# EasyEDA schematic SCH_CapibaraZero_PCB_2024-12-05.json

## Sheets
1 Sheet_1: TITLE: Sheet_1; REV: 1.0; Date: 2024-12-05; Sheet: 1/1; Drawn By: andreock; Company: Your Company
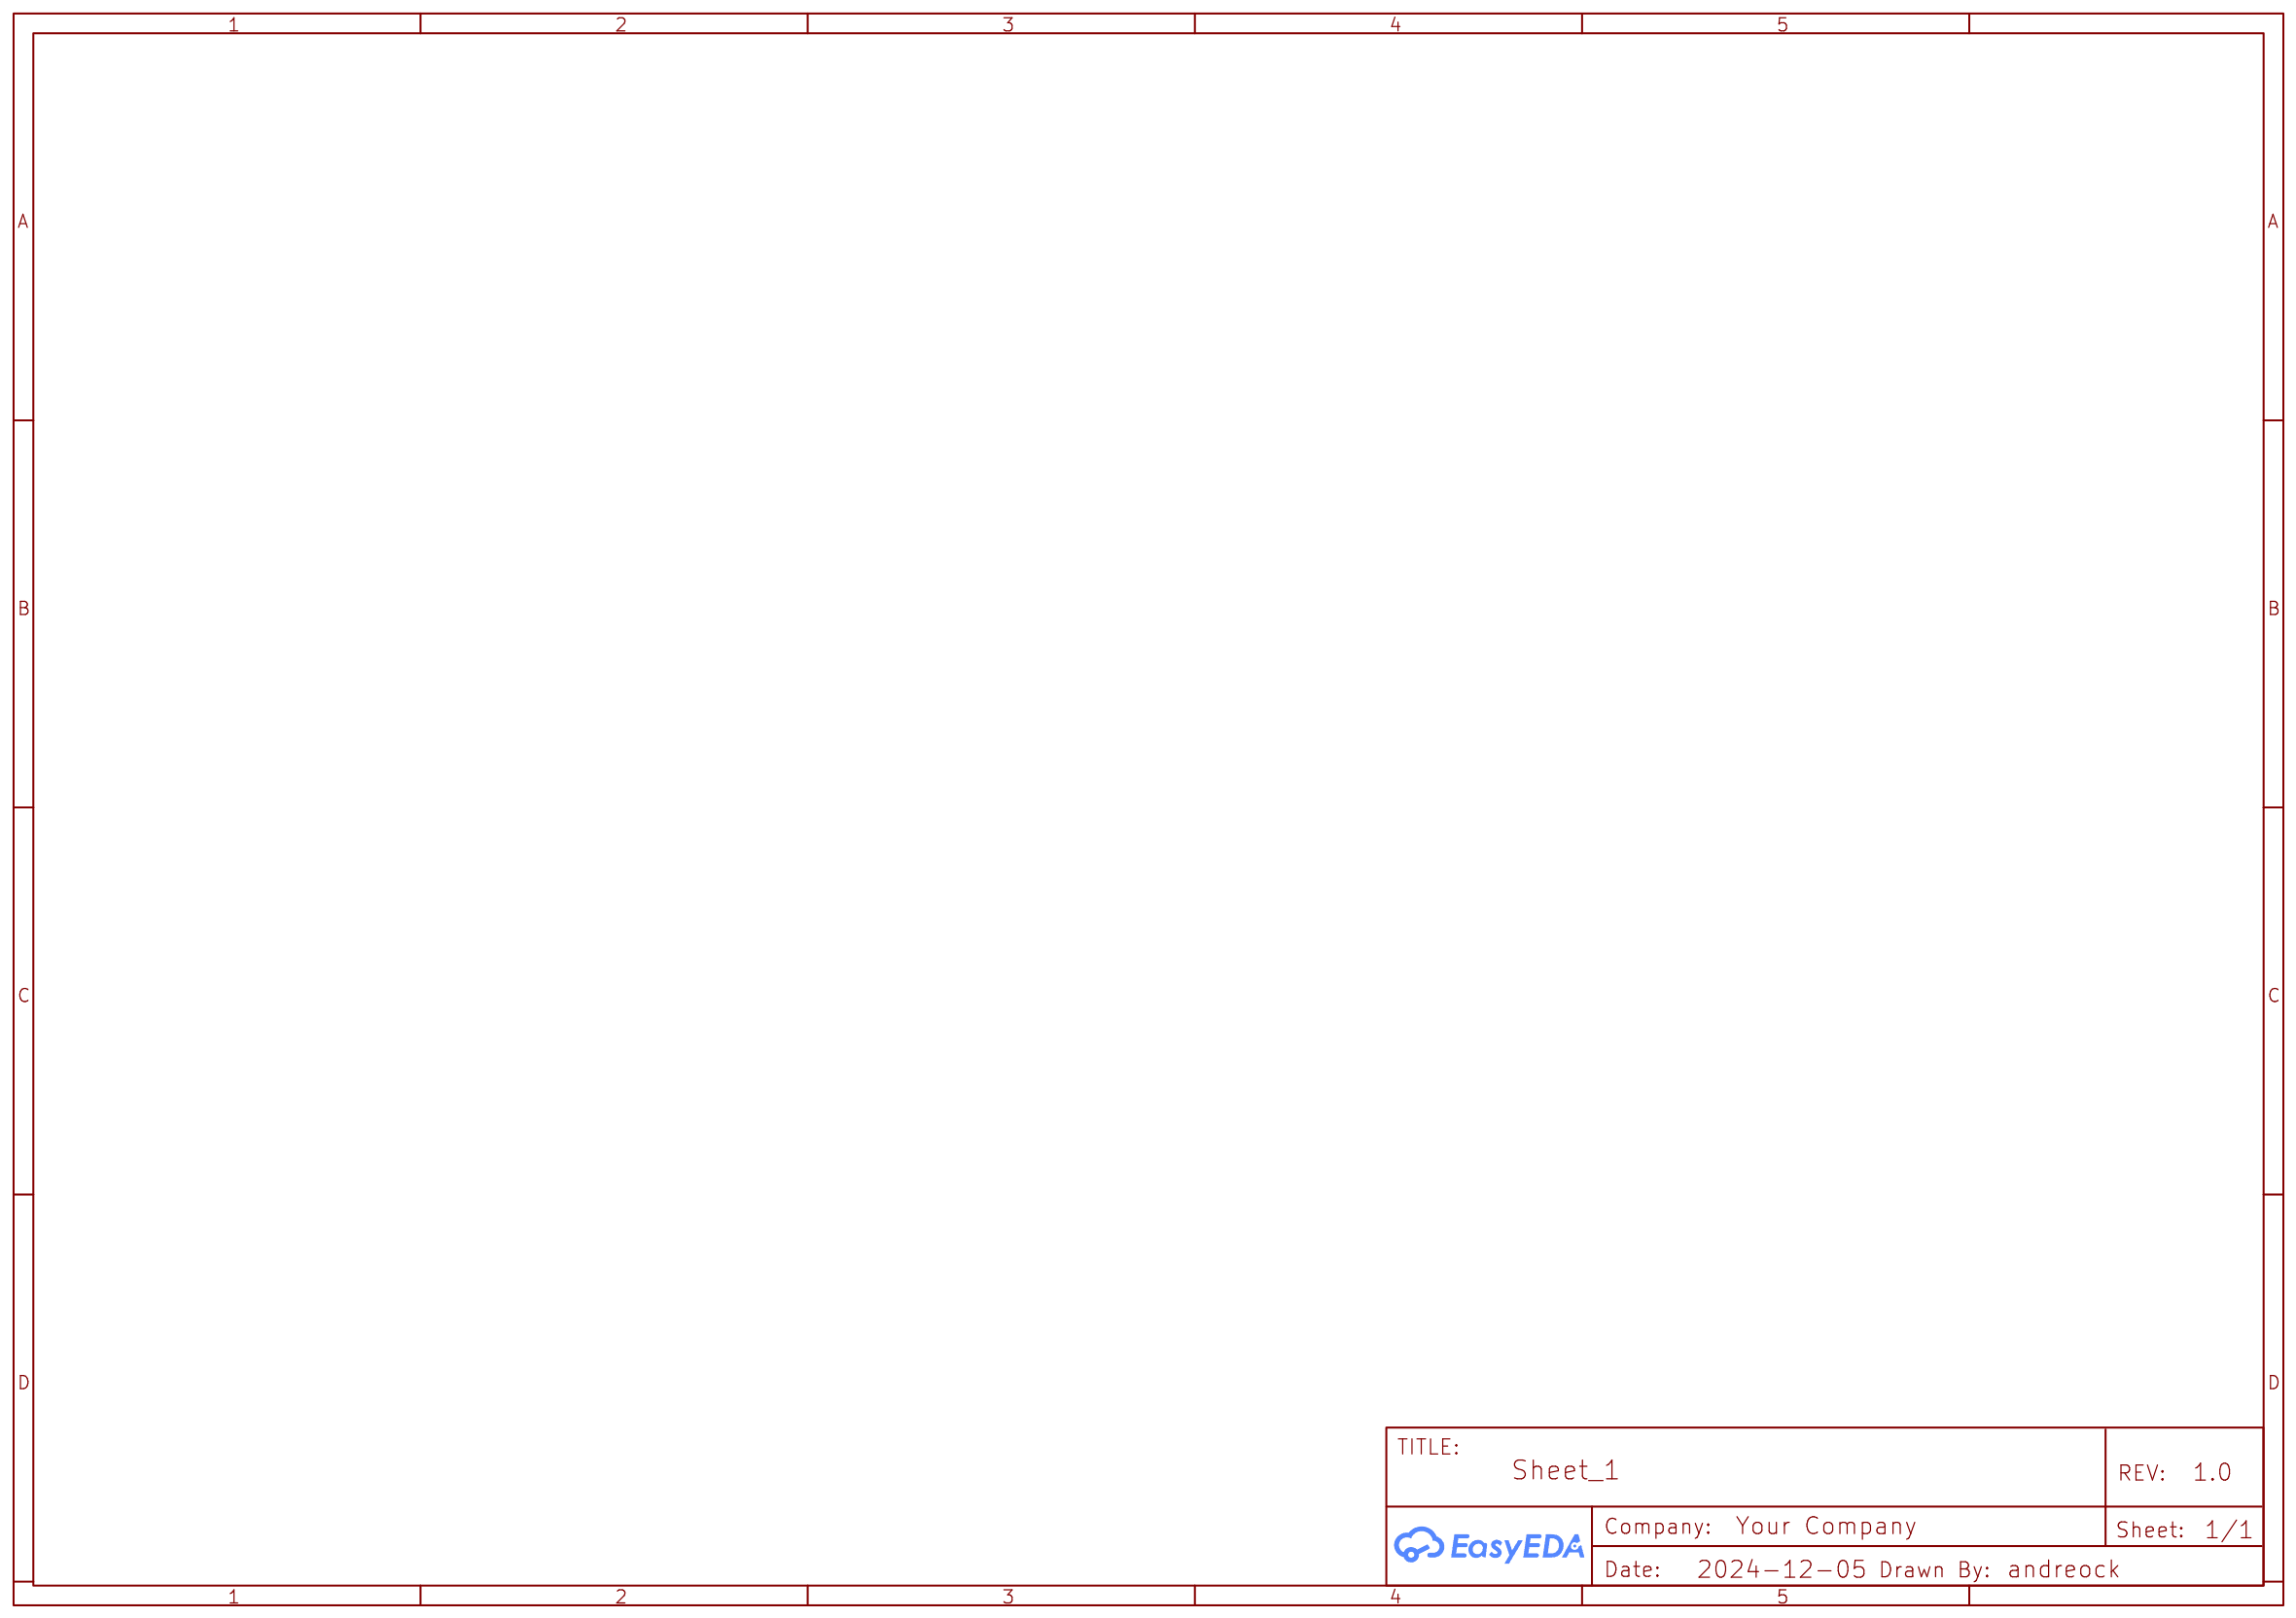
[diagram p0: Sheet_1]
2 CapibaraZero_Main_Scheme: TITLE: CapibaraZero_ESP32-S3; Date: 2024-04-09; Drawn By: Andrea Canale; Company: CapibaraZero
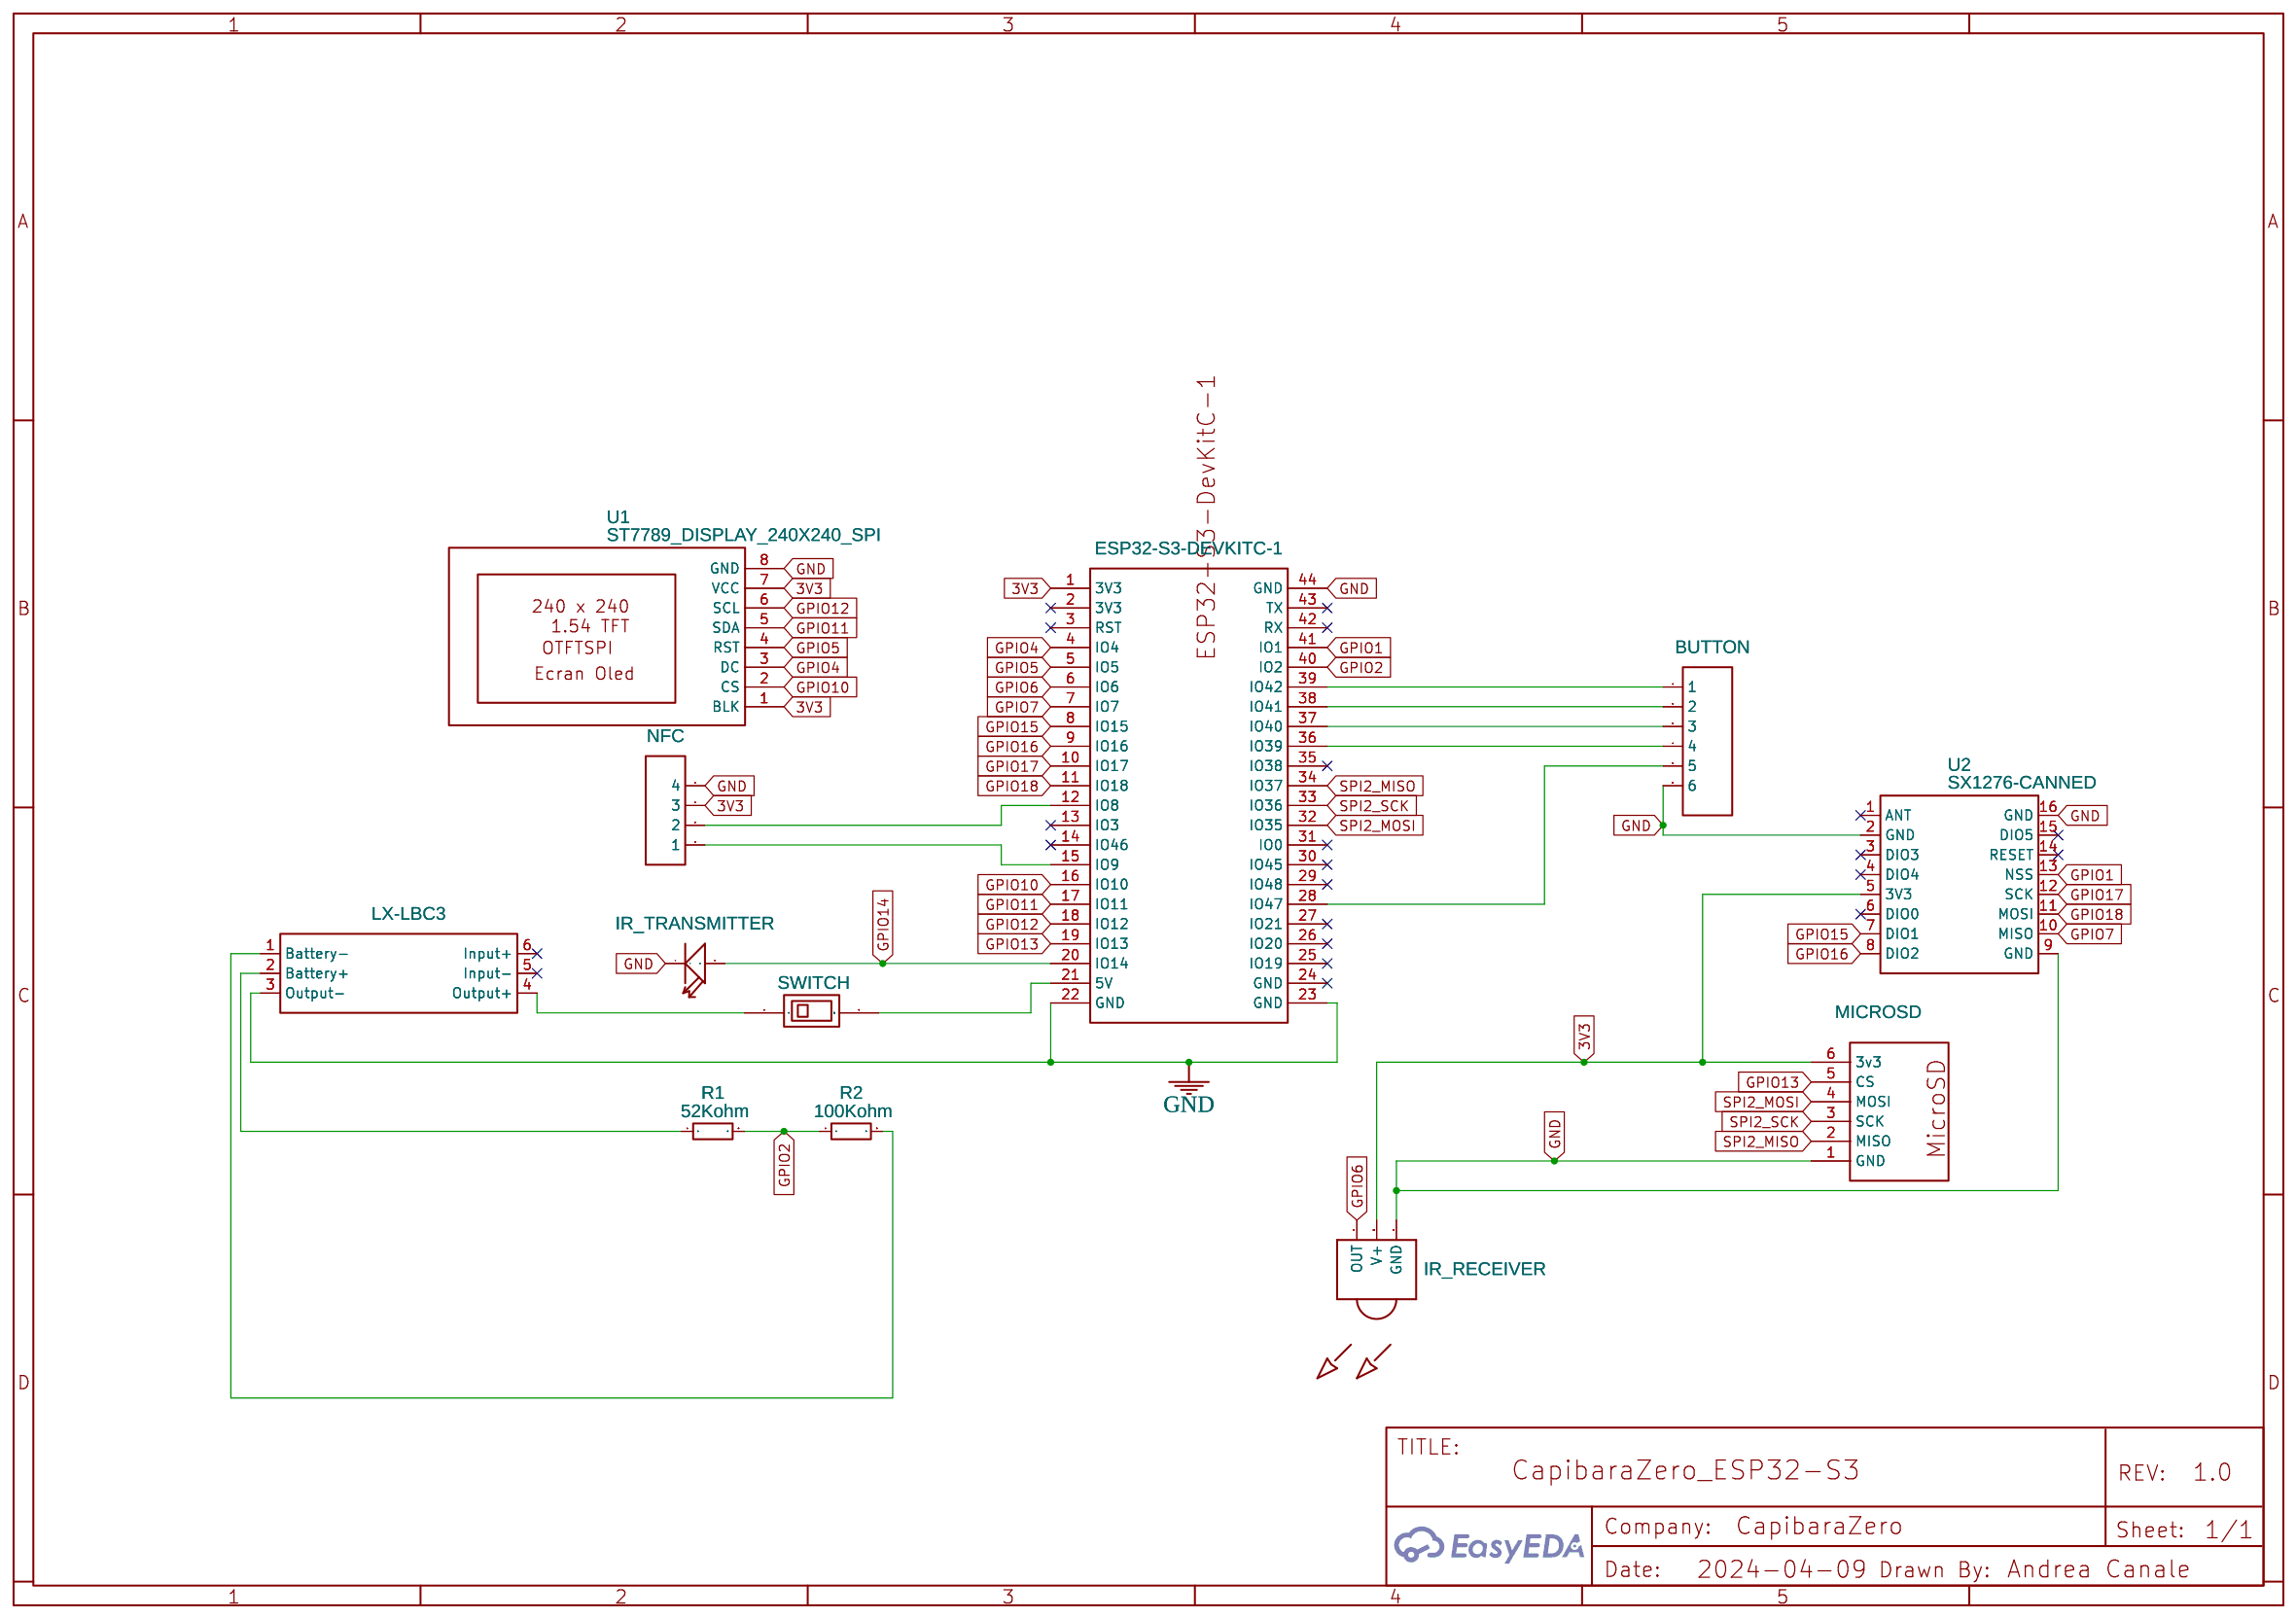
[diagram p1: CapibaraZero_Main_Scheme]
3 Navigation board: TITLE: Navigation Board; Date: 2024-02-09; Drawn By: vivanco11.ac
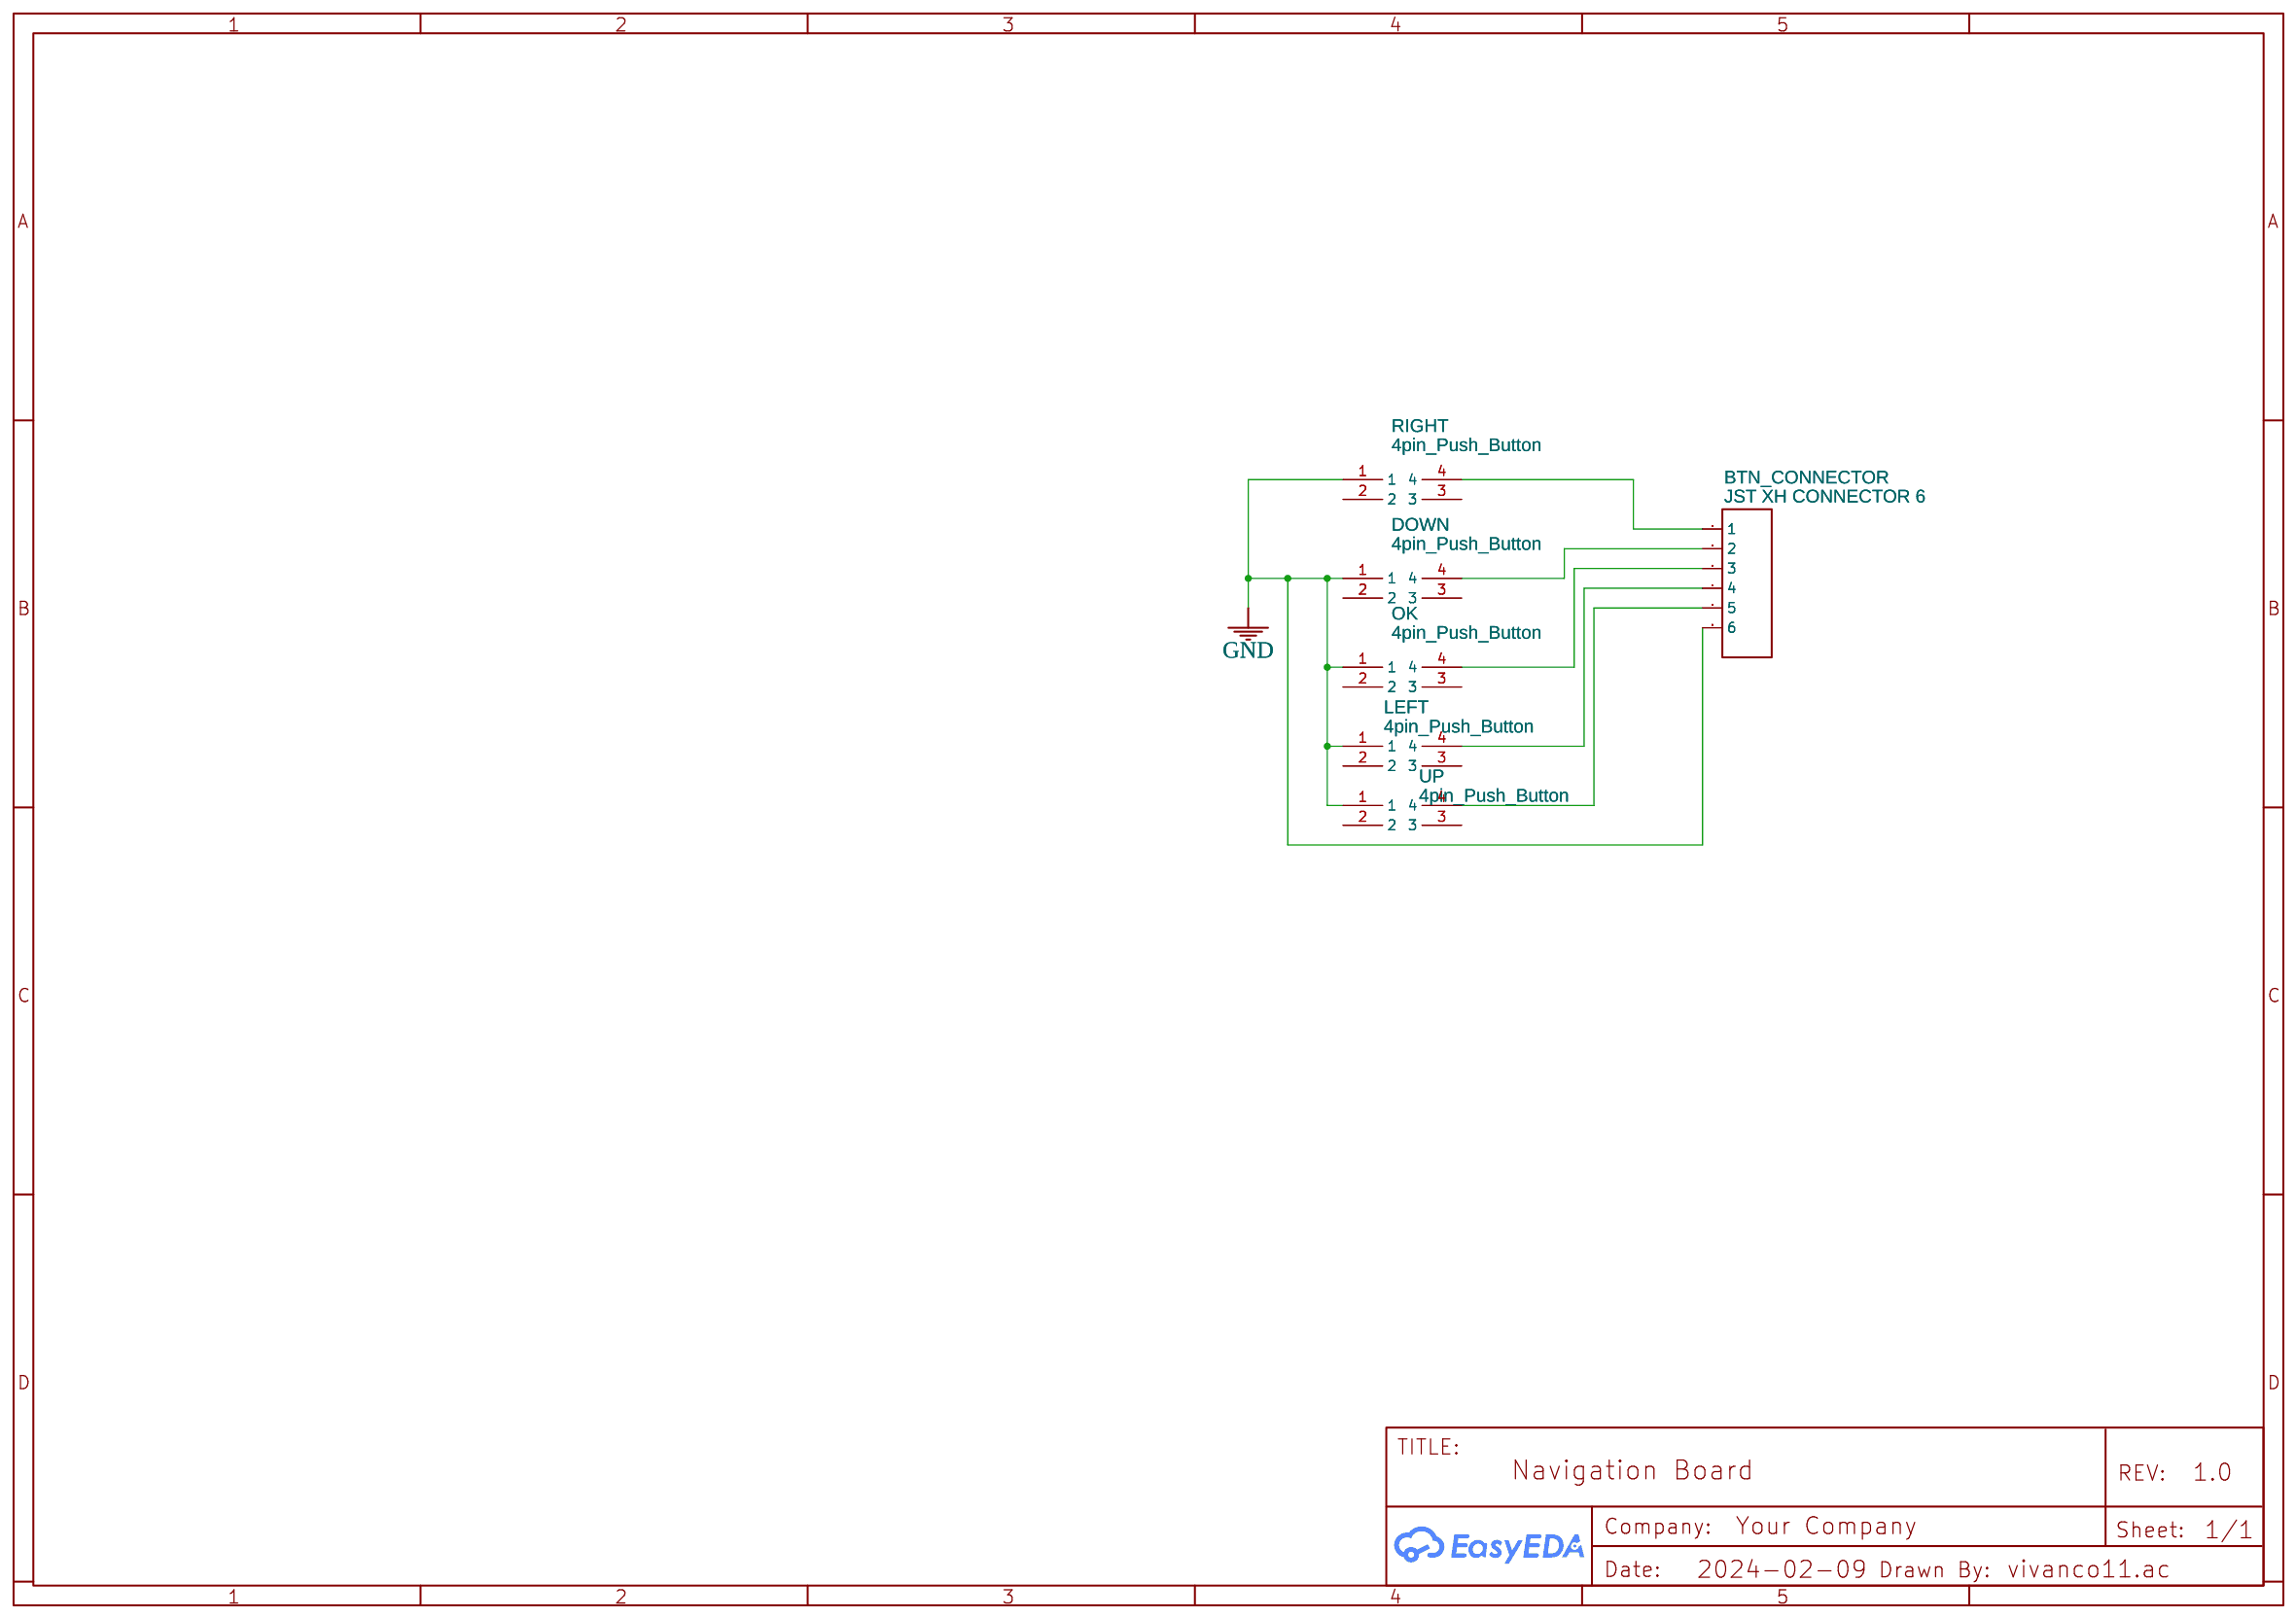
[diagram p2: Navigation board]

## Parts
sheet CapibaraZero_Main_Scheme
BUTTON  BTN Connector  [JST XH 6 PIN]
ESP32-S3-DEVKITC-1  ESP32-S3-DevKitC-1 development board  [ESP32-S3-DEVKITC-1 DEVELOPMENT BOARD]
IR_RECEIVER  IR RECEIVER  [TSOP18XX]
IR_TRANSMITTER  DIP-IR-LED-940NM(2P-D5MM)  [LED2-2.54-D5.0MM]
LX-LBC3  LX-LBC3  [LX-LBC3]
MICROSD  MicroSDSPI  [MICROSD SOCKET]
NFC  NFC Connector  [JST_XH_4X2.54MM]
R1  52Kohm  [RESISTOR]
R2  100Kohm  [RESISTOR]
SWITCH  1 Pole DIP switch  [1 POSITION DIP SWITCH]
U1  ST7789_DISPLAY_240X240_SPI  [1.54_DISPLAY_SPI]
U2  SX1276-CANNED  [SX1276-CANNED]
sheet Navigation board
BTN_CONNECTOR  JST XH CONNECTOR 6  [JST XH 6 PIN]
DOWN  4pin_Push_Button  [PUSH BUTTON 4 PIN DIP]
LEFT  4pin_Push_Button  [PUSH BUTTON 4 PIN DIP]
OK  4pin_Push_Button  [PUSH BUTTON 4 PIN DIP]
RIGHT  4pin_Push_Button  [PUSH BUTTON 4 PIN DIP]
UP  4pin_Push_Button  [PUSH BUTTON 4 PIN DIP]

## Library data of the parts
BTN_CONNECTOR BUTTON = JST XH CONNECTOR 6: Manufacturer Part: JST_XH CONNECTOR; link: https://nl.aliexpress.com/item/50-sets-Kit-in-doos-2-p-3-p-4-pin-2-54mm-Pitch-Terminal-Behuizing/32681086028.html?spm=a2g0s.9042311.0.0.I0g15Z; Contributor: vivanco11.ac
ESP32-S3-DEVKITC-1 = ESP32-S3-DevKitC-1 development board: Manufacturer: Espressif; Supplier: Espressif; Contributor: vivanco11.ac
IR_RECEIVER = IR TRANSMITTER: sourceId: vOawSeXH3; Contributor: vivanco11.ac
IR_TRANSMITTER = DIP-IR-LED-940NM(2P-D5MM): DIP IR LED 940nm; Supplier Part: 304090159; Supplier: SeeedStudio; Manufacturer Part: IR523B-W60W1; sourceId: iIBTN5nFX; Contributor: vivanco11.ac
LX-LBC3 = LX-LBC3: Contributor: vivanco11.ac
MICROSD = MicroSDSPI: catid: 20; Contributor: vivanco11.ac; sim: true
NFC = JST XH CONNECTOR 4: Manufacturer Part: JST_XH CONNECTOR; link: https://nl.aliexpress.com/item/50-sets-Kit-in-doos-2-p-3-p-4-pin-2-54mm-Pitch-Terminal-Behuizing/32681086028.html?spm=a2g0s.9042311.0.0.I0g15Z; Contributor: vivanco11.ac
R1 R2 = Resistor Normal: Supplier: LCSC; Supplier Part: X16151710; Manufacturer: ResistorToday; Manufacturer Part: EWWR0001J20R0T9; Contributor: vivanco11.ac
SWITCH = 1 Pole DIP switch: Contributor: vivanco11.ac
U1 = ST7789_DISPLAY_240X240_SPI: Contributor: vivanco11.ac
U2 = SX1276-CANNED: Manufacturer: G-NiceRF; Manufacturer Part: LoRa1276-C1; Supplier: Banggood; Supplier Part: Unknown; link: https://uk.banggood.com/LoRa1276-C1-SX1276-868MHz-LoRa-Module-Remote-Spread-Spectrum-Wireless-Module-20dBm-100mW-3-5KM-p-1416393.html?gmcCountry=GB¤cy=GBP&createTmp=1&utm_source=googleshopping&utm_medium=cpc_bgcs&utm_content=garman&utm_campaign=pla-gbg-ele-pc&gclid=EAIaIQobChMIouzku5XS4gIVipTtCh1cvgo9EAYYByABEgJIPfD_BwE&cur_warehouse=CN; Contributor: vivanco11.ac
DOWN LEFT OK RIGHT UP = 4pin_Push_Button: Contributor: vivanco11.ac

## Nets
3V3: ESP32-S3-DEVKITC-1.1(3V3) IR_RECEIVER.VCC(V+) MICROSD.6(3v3) NFC.3 U1.1(BLK) U1.7(VCC) U2.5(3V3)
GND: BTN_CONNECTOR.6 BUTTON.6 DOWN.1 ESP32-S3-DEVKITC-1.22(GND) ESP32-S3-DEVKITC-1.23(GND) ESP32-S3-DEVKITC-1.44(GND) IR_RECEIVER.GND IR_TRANSMITTER.- LEFT.1 LX-LBC3.3(Output-) MICROSD.1(GND) NFC.4 OK.1 RIGHT.1 U1.8(GND) U2.2(GND) U2.9(GND) U2.16(GND) UP.1
GPIO1: ESP32-S3-DEVKITC-1.41(IO1) U2.13(NSS)
GPIO2: ESP32-S3-DEVKITC-1.40(IO2) R1.2 R2.1
GPIO4: ESP32-S3-DEVKITC-1.4(IO4) U1.3(DC)
GPIO5: ESP32-S3-DEVKITC-1.5(IO5) U1.4(RST)
GPIO6: ESP32-S3-DEVKITC-1.6(IO6) IR_RECEIVER.OUT
GPIO7: ESP32-S3-DEVKITC-1.7(IO7) U2.10(MISO)
GPIO10: ESP32-S3-DEVKITC-1.16(IO10) U1.2(CS)
GPIO11: ESP32-S3-DEVKITC-1.17(IO11) U1.5(SDA)
GPIO12: ESP32-S3-DEVKITC-1.18(IO12) U1.6(SCL)
GPIO13: ESP32-S3-DEVKITC-1.19(IO13) MICROSD.5(CS)
GPIO14: ESP32-S3-DEVKITC-1.20(IO14) IR_TRANSMITTER.+
GPIO15: ESP32-S3-DEVKITC-1.8(IO15) U2.7(DIO1)
GPIO16: ESP32-S3-DEVKITC-1.9(IO16) U2.8(DIO2)
GPIO17: ESP32-S3-DEVKITC-1.10(IO17) U2.12(SCK)
GPIO18: ESP32-S3-DEVKITC-1.11(IO18) U2.11(MOSI)
SPI2_MISO: ESP32-S3-DEVKITC-1.34(IO37) MICROSD.2(MISO)
SPI2_MOSI: ESP32-S3-DEVKITC-1.32(IO35) MICROSD.4(MOSI)
SPI2_SCK: ESP32-S3-DEVKITC-1.33(IO36) MICROSD.3(SCK)
Net-(BTN_CONNECTOR-1): BTN_CONNECTOR.1 RIGHT.4
Net-(BTN_CONNECTOR-2): BTN_CONNECTOR.2 DOWN.4
Net-(BTN_CONNECTOR-3): BTN_CONNECTOR.3 OK.4
Net-(BTN_CONNECTOR-4): BTN_CONNECTOR.4 LEFT.4
Net-(BTN_CONNECTOR-5): BTN_CONNECTOR.5 UP.4
Net-(BUTTON-1): BUTTON.1 ESP32-S3-DEVKITC-1.39(IO42)
Net-(BUTTON-2): BUTTON.2 ESP32-S3-DEVKITC-1.38(IO41)
Net-(BUTTON-3): BUTTON.3 ESP32-S3-DEVKITC-1.37(IO40)
Net-(BUTTON-4): BUTTON.4 ESP32-S3-DEVKITC-1.36(IO39)
Net-(BUTTON-5): BUTTON.5 ESP32-S3-DEVKITC-1.28(IO47)
Net-(ESP32-S3-DEVKITC-1-12): ESP32-S3-DEVKITC-1.12(IO8) NFC.2
Net-(ESP32-S3-DEVKITC-1-15): ESP32-S3-DEVKITC-1.15(IO9) NFC.1
Net-(ESP32-S3-DEVKITC-1-21): ESP32-S3-DEVKITC-1.21(5V) SWITCH.2(OUT)
Net-(LX-LBC3-1): LX-LBC3.1(Battery-) R2.2
Net-(LX-LBC3-2): LX-LBC3.2(Battery+) R1.1
Net-(LX-LBC3-4): LX-LBC3.4(Output+) SWITCH.1(IN)

Not connected (* = marked no-connect by the designer): DOWN 2 3; ESP32-S3-DEVKITC-1 2(3V3)* 3(RST)* 13(IO3)* 14(IO46)* 24(GND)* 25(IO19)* 26(IO20)* 27(IO21)* 29(IO48)* 30(IO45)* 31(IO0)* 35(IO38)* 42(RX)* 43(TX)*; LEFT 2 3; LX-LBC3 5(Input-)* 6(Input+)*; OK 2 3; RIGHT 2 3; U2 1(ANT)* 3(DIO3)* 4(DIO4)* 6(DIO0)* 14(RESET)* 15(DIO5)*; UP 2 3
